# Altium schematic sheet SH5 - CAN.SchDoc: Gimbal - CAN
size Letter; Author: Jing Hao Yao; DrawnBy: Aidan Gratton & Jing Hao Yao; Organization: UW Robotics; Address1: 200 University Avenue; Address2: Waterloo; Address3: Ontario; Address4: Canada N2L 3G6; SheetNumber: 5; SheetTotal: 7
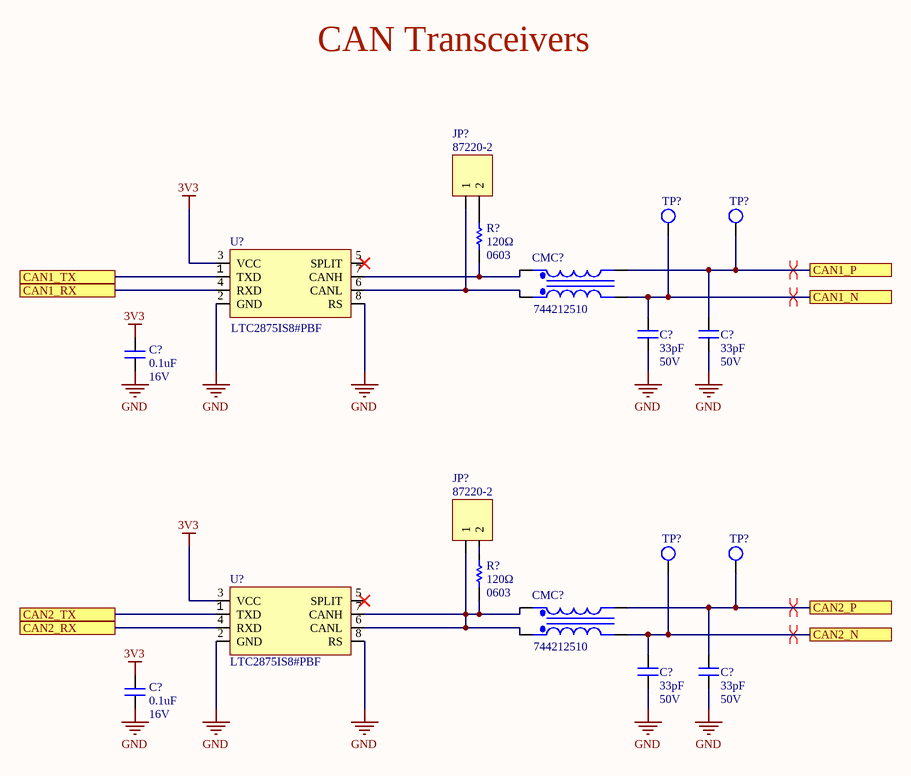
[diagram p0: SH5 - CAN.SchDoc]

## Parts
(Parts that share a designator on the sheet are numbered #1, #2 ... from top to bottom, then left to right.)
C?#1  value 33pF  Voltage: 50V  [CAPC0603(1608)55_N]  (hidden comment: CAP_33pF_50V_0603)
C?#2  value 33pF  Voltage: 50V  [CAPC0603(1608)55_N]  (hidden comment: CAP_33pF_50V_0603)
C?#3  value 0.1uF  Voltage Rating: 16V  [CAPC0603(1608)55_N]  (hidden comment: CAP_0.1uF_16V_0603)
C?#4  value 33pF  Voltage: 50V  [CAPC0603(1608)55_N]  (hidden comment: CAP_33pF_50V_0603)
C?#5  value 33pF  Voltage: 50V  [CAPC0603(1608)55_N]  (hidden comment: CAP_33pF_50V_0603)
C?#6  value 0.1uF  Voltage Rating: 16V  [CAPC0603(1608)55_N]  (hidden comment: CAP_0.1uF_16V_0603)
CMC?#1  CMC_51uH  [744212510]  (value not drawn)
CMC?#2  CMC_51uH  [744212510]  (value not drawn)
JP?#1  Manufacturer Part Number 1: 87220-2  [HDR1X2]  (hidden comment: JUMPER_2)
JP?#2  Manufacturer Part Number 1: 87220-2  [HDR1X2]  (hidden comment: JUMPER_2)
R?#1  value 120Ω  Case Code (Imperial): 0603  [RESC0603(1608)_N]  (hidden comment: RES_120Ω_0603)
R?#2  value 120Ω  Case Code (Imperial): 0603  [RESC0603(1608)_N]  (hidden comment: RES_120Ω_0603)
TP?#1  TESTPOINT_LOOP  [TESTPOINT_LOOP]  (value not drawn)
TP?#2  TESTPOINT_LOOP  [TESTPOINT_LOOP]  (value not drawn)
TP?#3  TESTPOINT_LOOP  [TESTPOINT_LOOP]  (value not drawn)
TP?#4  TESTPOINT_LOOP  [TESTPOINT_LOOP]  (value not drawn)
U?#1  Manufacturer Part Number 1: LTC2875IS8#PBF  [LT-S8_N]  (hidden comment: IC TXRX CAN)
U?#2  Manufacturer Part Number 1: LTC2875IS8#PBF  [LT-S8_N]  (hidden comment: IC TXRX CAN)

## Ports
CAN1_N, CAN1_P, CAN1_RX, CAN1_TX, CAN2_N, CAN2_P, CAN2_RX, CAN2_TX

## Nets
3V3: C?#3.1 C?#6.1 U?#1.3(VCC) U?#2.3(VCC)
GND: C?#1.1 C?#2.1 C?#3.2 C?#4.1 C?#5.1 C?#6.2 U?#1.2(GND) U?#1.8(RS) U?#2.2(GND) U?#2.8(RS)
CAN1_N: C?#1.2 CMC?#1.5(Pri-) TP?#1.1 ; port CAN1_N
CAN1_P: C?#2.2 CMC?#1.4(Sec-) TP?#2.1 ; port CAN1_P
CAN1_RX: U?#1.4(RXD) ; port CAN1_RX
CAN1_TX: U?#1.1(TXD) ; port CAN1_TX
CAN2_N: C?#4.2 CMC?#2.5(Pri-) TP?#3.1 ; port CAN2_N
CAN2_P: C?#5.2 CMC?#2.4(Sec-) TP?#4.1 ; port CAN2_P
CAN2_RX: U?#2.4(RXD) ; port CAN2_RX
CAN2_TX: U?#2.1(TXD) ; port CAN2_TX
NetCMC?#1_1: CMC?#1.1(Pri+) JP?#1.1 U?#1.6(CANL)
NetCMC?#1_3: CMC?#1.3(Sec+) R?#1.1 U?#1.7(CANH)
NetCMC?#2_1: CMC?#2.1(Pri+) CMC?#2.3(Sec+) JP?#2.1 R?#2.1 U?#2.6(CANL) U?#2.7(CANH)
NetJP?#1_2: JP?#1.2 R?#1.2
NetJP?#2_2: JP?#2.2 R?#2.2

Not connected (* = marked no-connect by the designer): U?#1 5(SPLIT)*; U?#2 5(SPLIT)*

## Layout directives
differential pair: CAN1_N, CAN1_P, CAN2_N, CAN2_P

## Notes on the sheet
- CAN Transceivers
- Title
- Size:
- Date:
- Letter
- Drawn By:
- Sheet
- of
- File:

## Library data of the parts
C?#1 C?#2 C?#4 C?#5 = CAP_33pF_50V_0603: CAP CER 33PF 50V C0G/NP0; Manufacturer 1: Yageo; Manufacturer Part Number 1: CC0603JRNPO9BN330; Dielectric Material: Ceramic; Temperature Coefficient: 30ppm/°C; Tolerance: 5%; Dielectric: C0G, NP0; Insulation Resistance: 100GR; Supplier 1: Digi-Key; Mount: Surface Mount; Number of Pins: 2; Case Code (Metric): 1608; Min Operating Temperature: -55°C; Max Operating Temperature: 125°C; Termination: SMD/SMT; Composition: Ceramic; Voltage Rating: 50V; Voltage Rating (DC): 50V; Length: 1.6mm; Height: 0.8mm; Thickness: 0.035inch; Depth: 0.8mm; Width: 0.031inch; REACH SVHC: No SVHC; ComponentLink7URL: https://datasheet.ciiva.com/11464/upy-gp-np0-16v-to-50v-8-11464730.pdf?src-supplier=Avnet; ComponentLink7Description: https://datasheet.ciiva.com/11464/upy-gp-np0-16v-to-50v-8-11464730.pdf?src-supplier=Avnet; ComponentLink8URL: https://datasheet.ciiva.com/46430/1835847-46430155.pdf?src-supplier=Element14; ComponentLink8Description: https://datasheet.ciiva.com/46430/1835847-46430155.pdf?src-supplier=Element14; ComponentLink9URL: https://datasheet.ciiva.com/144/mlccorderingcode-144644.pdf?src-supplier=Digi-Key; ComponentLink9Description: https://datasheet.ciiva.com/144/mlccorderingcode-144644.pdf?src-supplier=Digi-Key; ComponentLink10URL: https://datasheet.ciiva.com/5426/upy-gp-np0-16v-to-50v-8-5426614.pdf?src-supplier=Mouser; ComponentLink10Description: https://datasheet.ciiva.com/5426/upy-gp-np0-16v-to-50v-8-5426614.pdf?src-supplier=Mouser; ComponentLink11URL: https://datasheet.ciiva.com/7978/1443161-7978142.pdf?src-supplier=Element14; ComponentLink11Description: https://datasheet.ciiva.com/7978/1443161-7978142.pdf?src-supplier=Element14; Supplier Part Number 1: 311-1064-1-ND; Package: 0603; Case Code (Imperial): 0603
C?#3 C?#6 = CAP_0.1uF_16V_0603: CAP CER 0.1UF 16V X7R 0603; Manufacturer Part Number 1: CC0603KRX7R7BB104; Manufacturer 1: Yageo; Dimensions: 0.063" L x 0.031" W (1.60mm x 0.80mm); Package: 0603 (1608 Metric); Temperature Coefficient: X7R; Supplier Part Number 1: 311-1088-1-ND; Supplier 1: Digi-Key; Mount: Surface Mount
CMC?#1 CMC?#2 = CMC_51uH: CMC 51uH 300MA 2LN SMD; Manufacturer 1: Wurth Electronics; Core Material: Ferrite; DC Resistance (DCR): 160mR; Test Frequency: 100kHz; Inductance Tolerance: 50%; Voltage Rating (DC): 80V; Number of Lines: 2; Impedance: 300R; Supplier 1: Digi-Key; Manufacturer Part Number 1: 744212510; Stock 1: 1070; Pricing 1: 1=4.22000, 10=4.16600, 50=3.76300, 100=3.62900, 500=3.36000 (USD); RoHS: Yes; Mount: Surface Mount; Case/Package: SMD/SMT; Number of Pins: 4; Min Operating Temperature: -40°C; Max Operating Temperature: 105°C; Current: 300mA; Max DC Current: 300mA; Termination: SMD/SMT; Current Rating: 300mA; Inductance: 51uH; Tolerance: 50%; Package Quantity: 1000; Packaging: Tape and Reel; Length: 6.5mm; Height: 1.65mm; Depth: 3.6mm; Width: 0.142inch; REACH SVHC: No SVHC; Lead Free: Lead Free; ComponentLink1URL: https://datasheet.ciiva.com/11800/0900766b8059564e-11800467.pdf?src-supplier=RSComponents; ComponentLink1Description: https://datasheet.ciiva.com/11800/0900766b8059564e-11800467.pdf?src-supplier=RSComponents; ComponentLink2URL: https://datasheet.ciiva.com/1130/744212510-1130407.pdf?src-supplier=Newark; ComponentLink2Description: https://datasheet.ciiva.com/1130/744212510-1130407.pdf?src-supplier=Newark; ComponentLink3URL: https://datasheet.ciiva.com/6048/1735560-6048484.pdf?src-supplier=Farnell; ComponentLink3Description: https://datasheet.ciiva.com/6048/1735560-6048484.pdf?src-supplier=Farnell; ComponentLink4URL: https://datasheet.ciiva.com/4952/744212510-77598-4952687.pdf?src-supplier=Mouser; ComponentLink4Description: https://datasheet.ciiva.com/4952/744212510-77598-4952687.pdf?src-supplier=Mouser; ComponentLink5URL: https://datasheet.ciiva.com/6216/744212510-6216346.pdf?src-supplier=Digi-Key; ComponentLink5Description: https://datasheet.ciiva.com/6216/744212510-6216346.pdf?src-supplier=Digi-Key; ComponentLink6URL: https://datasheet.ciiva.com/22705/1735560-22705131.pdf?src-supplier=Element14; ComponentLink6Description: https://datasheet.ciiva.com/22705/1735560-22705131.pdf?src-supplier=Element14; ComponentLink7URL: https://datasheet.ciiva.com/6216/744212510-6216348.pdf?src-supplier=Digi-Key; ComponentLink7Description: https://datasheet.ciiva.com/6216/744212510-6216348.pdf?src-supplier=Digi-Key; ComponentLink8URL: https://datasheet.ciiva.com/7764/1735560-7764951.pdf?src-supplier=Element14; ComponentLink8Description: https://datasheet.ciiva.com/7764/1735560-7764951.pdf?src-supplier=Element14; Supplier Part Number 1: 732-3941-1-ND
JP?#1 JP?#2 = JUMPER_2: HEADER 2X1; Manufacturer 1: TE Connectivity; Supplier 1: Digi-Key; Supplier Part Number 1: A26542-ND; Mount: Through Hole
R?#1 R?#2 = RES_120Ω_0603: RES SMD 120 OHM 5% 1/10W 0603; Manufacturer 1: Yageo; Manufacturer Part Number 1: RC0603JR-07120RL; Package: 0603 (1608 Metric); Dimensions: 0.063" L x 0.031" W (1.60mm x 0.80mm); Supplier Part Number 1: 311-120GRCT-ND; Supplier 1: Digi-Key; Mount: Surface Mount; Case Code (Metric): 1608; Tolerance: 5%
TP?#1-TP?#4 = TESTPOINT_LOOP: Loop testpoint through-hole pad; Manufacturer 1: Keystone Electronics; Manufacturer Part Number 1: 5002; Supplier Part Number 1: 36-5002-ND; Supplier 1: Digi-Key; Mount: Through Hole
U?#1 U?#2 = LTC2875: IC TXRX CAN 4MBPS 8SO; Manufacturer 1: Linear Technologies; Package: 8-SOIC (0.154", 3.90mm Width); ComponentLink1Description: Datasheet; ComponentLink1URL: https://www.analog.com/media/en/technical-documentation/data-sheets/2875f.pdf; Supplier Part Number 1: LTC2875IS8#PBF-ND; Supplier 1: Digi-Key; Mount: Surface Mount